# Altium schematic sheet timer.SchDoc
size B
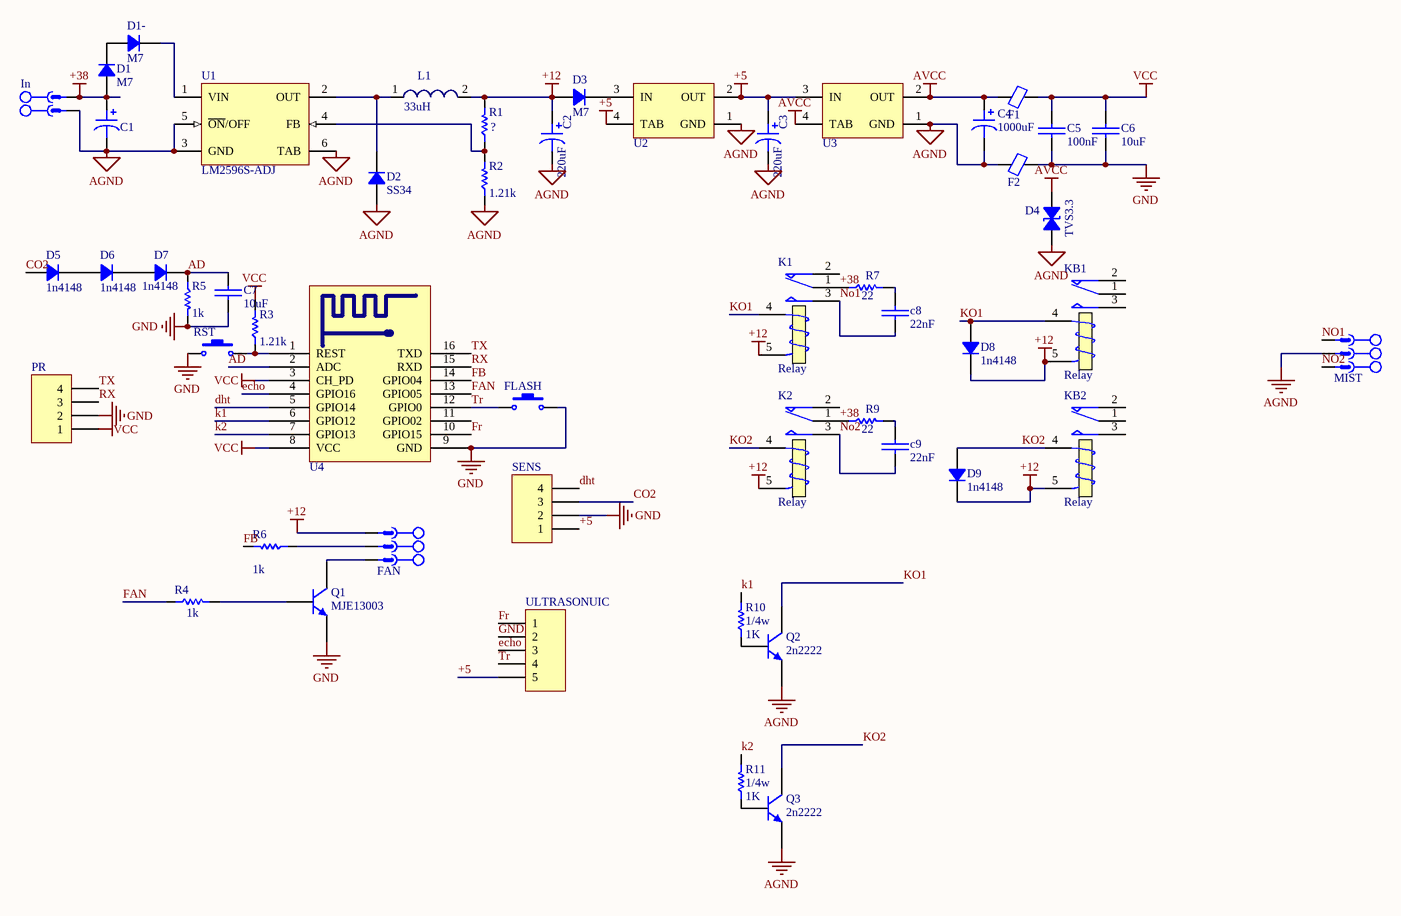
[diagram p0: timer.SchDoc]

## Parts
C1  Cap Polar  [CAP ALSMD POLY 8.3MM H10.5MM]  (value not drawn)
C2  220uF  [CAP ALSMD 6.6MM H8.0MM]
C3  220uF  [CAP ALSMD 6.6MM H8.0MM]
C4  1000uF  [CAP ALSMD POLY 8.3MM H10.5MM]
C5  100nF  [SMD_CAP_0805]
C6  10uF  [SMD_CAP_0805]
C7  10uF  [SMD_CAP_0805]
c8  22nF  [CAP-20]
c9  22nF  [CAP-20]
D1  M7  [DO214AB SMC]
D1-  M7  [DO214AB SMC]
D2  SS34  [DO214AB SMC]
D3  M7  [DO214AB SMC]
D4  TVS3.3  [ST DO214AA SMB]
D5  1n4148  [SOD-80 MiniMELF]
D6  1n4148  [SOD-80 MiniMELF]
D7  1n4148  [SOD-80 MiniMELF]
D8  1n4148  [SOD-80 MiniMELF]
D9  1n4148  [SOD-80 MiniMELF]
F1  Ferrite Bead SMD  [FB0805]  (value not drawn)
F2  Ferrite Bead SMD  [FB0805]  (value not drawn)
FAN  FCI-381-3P  [FCI 06-381-3PIN]  (value not drawn)
FLASH  Switch PB  [TE FSMSMTR]  (value not drawn)
In  (no value)  [MSTB 2,5/2-G-5,08]
K1  Relay  [Relay mini milon]
K2  Relay  [Relay mini milon]
KB1  Relay  [Relay-NT90]
KB2  Relay  [Relay-NT90]
L1  33uH  [BOURNS SRN8040]
MIST  FCI-381-3P  [MSTBV 2,5/3-G-5]  (value not drawn)
PR  Header 4  [HDR1X4]  (value not drawn)
Q1  MJE13003  [TO-252]
Q2  2n2222  [SOT23_N]
Q3  2n2222  [SOT23_N]
R1  ?  [RES 0805 (2012X06L)]
R2  1.21k  [RES 0805 (2012X06L)]
R3  1.21k  [RES 0805 (2012X06L)]
R4  1k  [RES 0805 (2012X06L)]
R5  1k  [RES 0805 (2012X06L)]
R6  1k  [RES 0805 (2012X06L)]
R7  22  [RES 2512 (6331X07L)]
R9  22  [RES 2512 (6331X07L)]
R10  Power: 1/4w  [RES 0805 (2012X06L)]  (hidden comment: 1K)
R11  Power: 1/4w  [RES 0805 (2012X06L)]  (hidden comment: 1K)
RST  Switch PB  [TE FSMSMTR]  (value not drawn)
SENS  Header 4  [HDR1X4]  (value not drawn)
U1  LM2596S-ADJ  [TS5B_M]
U2  AMS1117IMP-x.x_1  [TO-252-AMS1117]  (value not drawn)
U3  AMS1117IMP-x.x_1  [SOT223-AMS1117]  (value not drawn)
U4  ESP-8266  [ESP_12E]  (value not drawn)
ULTRASONUIC  Header 5  [HDR1X5]  (value not drawn)

## Nets
+5: C3.1 SENS.1 U2.2(OUT) U2.4(TAB) U3.3(IN) ULTRASONUIC.5
+12: C2.1 D3.1 D8.2 D9.2 FAN.1 K1.5(T2) K2.5(T2) KB1.5(T2) KB2.5(T2) L1.2 R1.2
+38: C1.1 D1.1 In.2 K1.1(COM) K2.1(COM) R7.1 R9.1
AGND: C1.2 C2.2 C3.2 C4.2 D2.1 D4.1 F2.2 In.1 MIST.2 Q2.2(E) Q3.2(E) R2.1 U1.3(GND) U1.5(~{ON}/OFF) U1.6(TAB) U2.1(GND) U3.1(GND)
AVCC: C4.1 D4.2 F1.2 U3.2(OUT) U3.4(TAB)
GND: C5.1(+) C6.1(+) C7.1(+) F2.1 FLASH.2 PR.2 Q1.3(E) R5.2 RST.1 SENS.2 U4.9(GND) ULTRASONUIC.2
VCC: C5.2(-) C6.2(-) F1.1 PR.1 R3.2 U4.3(CH_PD) U4.8(VCC)
AD: C7.2(-) D7.2 R5.1 U4.2(ADC)
CO2: D5.1 SENS.3
dht: SENS.4 U4.5(GPIO14)
echo: U4.4(GPIO16) ULTRASONUIC.3
FAN: R4.1 U4.13(GPIO05)
FB: R6.2 U4.14(GPIO04)
Fr: U4.10(GPIO15) ULTRASONUIC.1
k1: R10.2 U4.6(GPIO12)
k2: R11.2 U4.7(GPIO13)
KO1: D8.1 K1.4(T1) KB1.4(T1) Q2.3(C)
KO2: D9.1 K2.4(T1) KB2.4(T1) Q3.3(C)
No1: c8.2(-) K1.3(NO) MIST.1
No2: c9.2(-) K2.3(NO) MIST.3
RX: PR.3 U4.15(RXD)
Tr: FLASH.1 U4.12(GPIO0) ULTRASONUIC.4
TX: PR.4 U4.16(TXD)
Netc8_1: c8.1(+) R7.2
Netc9_1: c9.1(+) R9.2
NetD1-_2: D1-.2 U1.1(VIN)
NetD1_2: D1.2 D1-.1
NetD2_2: D2.2 L1.1 U1.2(OUT)
NetD3_2: D3.2 U2.3(IN)
NetD5_2: D5.2 D6.1
NetD6_2: D6.2 D7.1
NetFAN_2: FAN.2 R6.1
NetFAN_3: FAN.3 Q1.2(C)
NetQ1_1: Q1.1(B) R4.2
NetQ2_1: Q2.1(B) R10.1
NetQ3_1: Q3.1(B) R11.1
NetR1_1: R1.1 R2.2 U1.4(FB)
NetR3_1: R3.1 RST.2 U4.1(REST)

Not connected (* = marked no-connect by the designer): K1 2(NC); K2 2(NC); KB1 1(COM) 2(NC) 3(NO); KB2 1(COM) 2(NC) 3(NO); U4 11(GPIO02)

## Library data of the parts
C2-C4 = Cap Polar
C5-C7 c8 c9 = Cap-Bipolar: Bipolar Capacitor; Voltage: 100V; Designer: Saeid Jorablo; Organazation: ControTec; Adding Date: 1387/12/20
  C5: Value: 100nF
  C6 C7: Value: 10uF
  c8 c9: Value: 22nF
D1 D1- D2 D3 D5-D9 = Diode: Rectifier Diode
D4 = Diode TVS: Zener Diode
F1 F2 = Ferrite Bead SMD Package: Designer: Ali Hafizi
FAN MIST = FCI-381-3P: 6 Pitch: 5.08 mm Color: green Contact surface: Tin Assembly; Manufacturer: PHOENIX CONTACT; PART.NO: PHOENIX; Connector type: PCB Terminal Block; designer: ABBAS BASEREH; Max Current: 12 A; Positions: 6; Voltage: 320 V; Category: Connector; ComponentLink1Description: Header, Nominal current: 12 A Rated voltage (III/2): 320 V Number of positions: 6 Pitch: 5.08 mm Color: green Contact surface: Tin Assembly: Soldering  DESIGNER:ABBAS BASEREH; ComponentLink2Description: Reference; Mounting Technology: Through-Hole; Pin Count: 6; Revision 1: 2017-3-1; Status: Unreleased
FLASH RST = Switch PB: Push Button Switch
In = CON_Phoenix_MSTB_02: 2 Pitch: 5.08 mm Color: green Contact surface: Tin Assembly; pin to pad: 1>2 2>1; Manufacturer: PHOENIX CONTACT; Connector type: PCB Terminal Block; designer: ABBAS BASEREH; Max Current: 12 A; Positions: 2; Voltage: 320 V; Category: Connector; ComponentLink1Description: Header, Nominal current: 12 A Rated voltage (III/2): 320 V Number of positions: 2 Pitch: 5.08 mm Color: green Contact surface: Tin Assembly: Soldering  DESIGNER:ABBAS BASEREH; ComponentLink2Description: Reference; Mounting Technology: Through-Hole; Pin Count: 2; Revision 1: 2017-3-1; Status: Unreleased; PART.NO: PHOENIX
K1 K2 KB1 KB2 = Relay: SPDT Relay; Designer: Eng. Saeid Jorablo; Company: E.P.I.L; Design_Date: 2011/10/31
L1 = Inductor smd: SMD Power Inductor WE-LHMI, L=6.8 µH; PartNumber: 74437324068; Inductance: 6.8 µH; PackageReference: WE-LHMI 4020; ComponentLink1Description: Manufacturer URL; ComponentLink1URL: http://www.we-online.com; ComponentLink2Description: Datasheet; ComponentLink2URL: http://katalog.we-online.de/kataloge/eisos/media/pdf/74437324068.pdf
PR SENS = Header 4: Header, 4-Pin; LatestRevisionDate: 17-Jul-2002; LatestRevisionNote: Re-released for DXP Platform.; Publisher: Altium Limited
Q1 = NPN: NPN Transistor; Designer: Saeid Jorablo; Company: IPA CO; Last Update Time: 2008/08/04; Value: MJE13003
Q2 Q3 = BC817: 45 V, 500 mA NPN general-purpose transistors; Published: 2017-2-8; LatestRevisionDate: 2017; LatestRevisionNote: IPC-7351 Footprint Added.; DatasheetVersion: 2017; PackageVersion: 2017-2-8; PackageReference: SOT23; Publisher: Abbas Basereh; PackageDescription: 3-Pin SOT-23 Package 0.95 mm Pitch, 2.3 mm Lead Span; ComponentLink1Description: Manufacturer Link; ComponentLink1URL: http://www.nxp.com/; ComponentLink2Description: Datasheet; ComponentLink2URL: http://www.nxp.com/
R1-R7 R9-R11 = Resistor
  R1: VALUE: ?
  R2 R3: VALUE: 1.21k
  R4-R6: VALUE: 1k
  R7 R9: VALUE: 22
  R10 R11: VALUE: 1K
U1 = LM2596S-ADJ: SIMPLE SWITCHER® Power Converter 150 KHz 3A Step-Down Voltage Regulator, 5-pin TO-263; Manufacturer: National Semiconductor; PackageTopMarking: NSUZXYTTE#*LM2596S*-ADJ P+; PowerWise: N; High-Reliability: Y; DatasheetVersion: May-2002; PackageVersion: revD, Apr-2005; PackageReference: TS5B; PackageDescription: TO-263, Molded, .400 x .390 x .180in, 5 Lead, .067in Pitch, Surface Mount; PartNumber: LM2596S-ADJ; RoHS: N; PinCount: 5; CompType: Switcher; Code_JEDEC: MO-169-AB; ComponentLink1Description: Manufacturer URL; ComponentLink1URL: http://www.national.com/; ComponentLink2Description: LM2596 Datasheet; ComponentLink2URL: http://www.national.com/ds/LM/LM2596.pdf; ComponentLink3Description: LM2596 Web Page; ComponentLink3URL: http://www.national.com/pf/LM/LM2596.html; ComponentLink4Description: TS5B Package Page; ComponentLink4URL: http://www.national.com/packaging/folders/ts5b.html
U2 U3 = AMS1117IMP-x.x_1: x.x Volt, 800mA Low-Dropout Linear Regulator, 4-pin SOT-223; PartNumber: LM1117IMP-3.3; Manufacturer: National Semiconductor; PackageTopMarking: XYTT*N05B; PowerWise: N; CompType: LDO IC; Published: 4-Dec-2008; DatasheetVersion: Apr-2006; PackageVersion: revB, Apr-2003; PackageReference: MP04A; Publisher: Altium Limited; PackageDescription: Molded SOT-223, 6.50 x 3.56 x 1.6mm Body, 4 Lead, 2.3mm Pitch; Supplier 1: Farnell; Supplier Part Number 1: 7614123; RoHS: N; PinCount: 4; Code_JEDEC: TO-261-AA; Code_IPC: SOT223-4; ComponentLink1Description: LM1117 Datasheet; ComponentLink1URL: http://www.national.com/ds/LM/LM1117.pdf; ComponentLink2Description: LM1117 Web Page; ComponentLink2URL: http://www.national.com/pf/LM/LM1117.html; ComponentLink3Description: MP04A Package Page; ComponentLink3URL: http://www.national.com/packaging/folders/mp04a.html
ULTRASONUIC = Header 5: Header, 5-Pin; LatestRevisionDate: 17-Jul-2002; LatestRevisionNote: Re-released for DXP Platform.; Publisher: Altium Limited